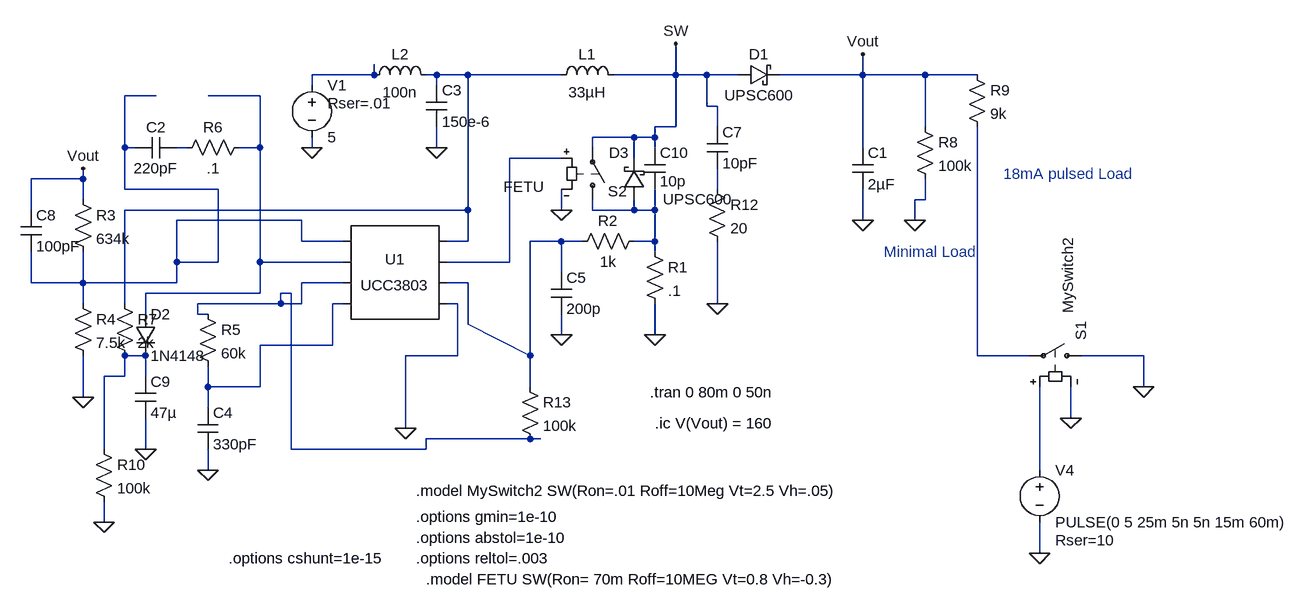
[diagram p0: schematic BoostSupply_160v.asc]
BoostSupply_160v.asc, the LTspice schematic file:
Version 4
SHEET 1 1576 680
WIRE 112 -144 112 -160
WIRE 112 -144 16 -144
WIRE 208 -144 192 -144
WIRE 256 -144 208 -144
WIRE 400 -144 256 -144
WIRE 576 -144 576 -192
WIRE 576 -144 480 -144
WIRE 624 -144 576 -144
WIRE 672 -144 624 -144
WIRE 864 -144 864 -176
WIRE 864 -144 736 -144
WIRE 960 -144 864 -144
WIRE 1040 -144 960 -144
WIRE 16 -128 16 -144
WIRE 208 -128 208 -144
WIRE -224 -112 -272 -112
WIRE -64 -112 -144 -112
WIRE 624 -96 624 -144
WIRE 640 -96 624 -96
WIRE 576 -64 576 -144
WIRE 576 -64 544 -64
WIRE 640 -64 640 -96
WIRE 960 -64 960 -144
WIRE 512 -48 448 -48
WIRE 544 -48 544 -64
WIRE 544 -48 512 -48
WIRE -272 -32 -272 -112
WIRE -256 -32 -272 -32
WIRE -176 -32 -192 -32
WIRE -64 -32 -64 -112
WIRE -64 -32 -96 -32
WIRE 16 -32 16 -48
WIRE 208 -32 208 -64
WIRE 448 -32 448 -48
WIRE 544 -32 544 -48
WIRE 864 -32 864 -144
WIRE 400 -16 320 -16
WIRE 512 -16 512 -48
WIRE -336 16 -336 0
WIRE -336 16 -416 16
WIRE -272 32 -272 -32
WIRE -128 32 -272 32
WIRE 640 32 640 0
WIRE -336 48 -336 16
WIRE 960 48 960 16
WIRE 960 48 944 48
WIRE -416 64 -416 16
WIRE 256 64 256 -144
WIRE 256 64 -272 64
WIRE 400 64 400 32
WIRE 448 64 448 48
WIRE 512 64 512 48
WIRE 512 64 448 64
WIRE 544 64 544 32
WIRE 544 64 512 64
WIRE 0 80 -192 80
WIRE 864 80 864 32
WIRE 944 80 944 48
WIRE 0 112 0 80
WIRE 64 112 0 112
WIRE 256 112 256 64
WIRE 256 112 224 112
WIRE 400 112 352 112
WIRE 432 112 400 112
WIRE 544 112 544 64
WIRE 544 112 512 112
WIRE 544 128 544 112
WIRE -192 144 -192 80
WIRE -128 144 -128 32
WIRE -128 144 -192 144
WIRE -64 144 -64 -32
WIRE 64 144 -64 144
WIRE 320 144 320 -16
WIRE 320 144 224 144
WIRE 400 160 400 112
WIRE -416 176 -416 128
WIRE -336 176 -336 128
WIRE -336 176 -416 176
WIRE -192 176 -192 144
WIRE -192 176 -336 176
WIRE 64 176 0 176
WIRE 256 176 224 176
WIRE -64 192 -64 144
WIRE -64 192 -240 192
WIRE -16 192 -32 192
WIRE -336 208 -336 176
WIRE -272 208 -272 64
WIRE -32 208 -32 192
WIRE -32 208 -160 208
WIRE 0 208 0 176
WIRE 0 208 -32 208
WIRE 64 208 48 208
WIRE 240 208 224 208
WIRE 640 208 640 112
WIRE -240 224 -240 192
WIRE -160 224 -160 208
WIRE -144 224 -160 224
WIRE 256 240 256 176
WIRE 400 256 400 224
WIRE 544 256 544 208
WIRE 48 272 48 208
WIRE 48 272 -64 272
WIRE -240 288 -272 288
WIRE 240 288 240 208
WIRE 240 288 160 288
WIRE 352 288 352 112
WIRE 352 288 256 240
WIRE 1040 288 1040 -64
WIRE 1120 288 1040 288
WIRE 1296 288 1200 288
WIRE -272 320 -272 288
WIRE -272 320 -304 320
WIRE -240 320 -240 288
WIRE -144 336 -144 304
WIRE -64 336 -64 272
WIRE -64 336 -144 336
WIRE 352 336 352 288
WIRE 1296 336 1296 288
WIRE -336 352 -336 288
WIRE -144 368 -144 336
WIRE 1184 384 1184 336
WIRE 160 400 160 288
WIRE 352 416 192 416
WIRE 368 416 352 416
WIRE -304 432 -304 320
WIRE -240 432 -240 384
WIRE -16 432 -16 192
WIRE 192 432 192 416
WIRE 192 432 -16 432
WIRE -144 464 -144 432
WIRE 1136 464 1136 336
WIRE -304 544 -304 512
WIRE 1136 592 1136 544
FLAG 208 -32 0
FLAG 864 80 0
FLAG 544 256 0
FLAG 160 400 0
FLAG 400 256 0
FLAG 16 -32 0
FLAG 864 -176 Vout
FLAG -336 0 Vout
FLAG -336 352 0
FLAG -144 464 0
FLAG 944 80 0
FLAG 1184 384 0
FLAG 1136 592 0
FLAG 1296 336 0
FLAG 640 208 0
FLAG -240 432 0
FLAG -304 544 0
FLAG 400 64 0
FLAG 576 -192 SW
SYMBOL res 528 112 R0
SYMATTR InstName R1
SYMATTR Value .1
SYMBOL ind 384 -128 R270
WINDOW 0 32 56 VTop 2
WINDOW 3 5 56 VBottom 2
SYMATTR InstName L1
SYMATTR Value 33µH
SYMATTR SpiceLine Rser=.045
SYMBOL schottky 672 -128 R270
WINDOW 0 32 32 VTop 2
WINDOW 3 0 32 VBottom 2
SYMATTR InstName D1
SYMATTR Value UPSC600
SYMATTR Description Diode
SYMATTR Type diode
SYMBOL cap 848 -32 R0
SYMATTR InstName C1
SYMATTR Value 2µF
SYMBOL cap 192 -128 R0
SYMATTR InstName C3
SYMATTR Value 150e-6
SYMATTR SpiceLine Lser=.05n
SYMBOL res 528 96 R90
WINDOW 0 0 56 VBottom 2
WINDOW 3 32 56 VTop 2
SYMATTR InstName R2
SYMATTR Value 1k
SYMBOL cap 384 160 R0
SYMATTR InstName C5
SYMATTR Value 200p
SYMBOL voltage 16 -144 R0
WINDOW 123 0 0 Left 2
WINDOW 39 24 44 Left 2
SYMATTR SpiceLine Rser=.01
SYMATTR InstName V1
SYMATTR Value 5
SYMBOL res -352 32 R0
SYMATTR InstName R3
SYMATTR Value 634k
SYMBOL res -352 192 R0
SYMATTR InstName R4
SYMATTR Value 7.5k
SYMBOL cap -192 -48 R90
WINDOW 0 0 32 VBottom 2
WINDOW 3 32 32 VTop 2
SYMATTR InstName C2
SYMATTR Value 220pF
SYMBOL cap -160 368 R0
SYMATTR InstName C4
SYMATTR Value 330pF
SYMBOL res -160 208 R0
SYMATTR InstName R5
SYMATTR Value 60k
SYMBOL res -80 -48 R90
WINDOW 0 0 56 VBottom 2
WINDOW 3 32 56 VTop 2
SYMATTR InstName R6
SYMATTR Value .1
SYMBOL res 944 -80 R0
SYMATTR InstName R8
SYMATTR Value 100k
SYMBOL res 1024 -160 R0
SYMATTR InstName R9
SYMATTR Value 9k
SYMBOL voltage 1136 448 R0
WINDOW 123 0 0 Left 2
WINDOW 39 24 124 Left 2
SYMATTR SpiceLine Rser=10
SYMATTR InstName V4
SYMATTR Value PULSE(0 5 25m 5n 5n 15m 60m)
SYMBOL sw 1216 288 M270
WINDOW 3 65 36 Left 2
SYMATTR Value MySwitch2
SYMATTR InstName S1
SYMBOL cap 624 -64 R0
SYMATTR InstName C7
SYMATTR Value 10pF
SYMBOL res 624 16 R0
SYMATTR InstName R12
SYMATTR Value 20
SYMBOL cap -432 64 R0
SYMATTR InstName C8
SYMATTR Value 100pF
SYMBOL cap -256 320 R0
SYMATTR InstName C9
SYMATTR Value 47µ
SYMBOL res -288 192 R0
SYMATTR InstName R7
SYMATTR Value 2k
SYMBOL diode -256 224 R0
SYMATTR InstName D2
SYMATTR Value 1N4148
SYMBOL res -320 416 R0
SYMATTR InstName R10
SYMATTR Value 100k
SYMBOL sw 448 64 M180
WINDOW 3 -137 36 Left 2
WINDOW 0 24 29 Left 2
SYMATTR Value FETU
SYMATTR InstName S2
SYMBOL schottky 528 48 R180
WINDOW 0 24 72 Left 2
WINDOW 3 -135 1 Left 2
SYMATTR InstName D3
SYMATTR Value UPSC600
SYMATTR Description Diode
SYMATTR Type diode
SYMBOL cap 528 -32 R0
WINDOW 3 24 52 Left 2
SYMATTR Value 10p
SYMATTR InstName C10
SYMATTR SpiceLine Rser=10m
SYMBOL res 336 320 R0
SYMATTR InstName R13
SYMATTR Value 100k
SYMBOL ind 96 -128 R270
WINDOW 0 32 56 VTop 2
WINDOW 3 5 56 VBottom 2
SYMATTR InstName L2
SYMATTR Value 100n
SYMATTR SpiceLine Rser=.02
SYMBOL AutoGenerated\\UCC3803 144 160 R0
SYMATTR InstName U1
TEXT 536 344 Left 2 !.tran 0 80m 0 50n
TEXT 544 392 Left 2 !.ic V(Vout) = 160
TEXT 176 496 Left 2 !.model MySwitch2 SW(Ron=.01 Roff=10Meg Vt=2.5 Vh=.05)
TEXT 176 536 Left 2 !.options gmin=1e-10
TEXT 176 568 Left 2 !.options abstol=1e-10
TEXT 176 600 Left 2 !.options reltol=.003
TEXT -112 600 Left 2 !.options cshunt=1e-15
TEXT 192 632 Left 2 !.model FETU SW(Ron= 70m Roff=10MEG Vt=0.8 Vh=-0.3)
TEXT 1080 8 Left 2 ;18mA pulsed Load
TEXT 896 128 Left 2 ;Minimal Load

The netlist it stands for:
* BoostSupply_160v.asc
R1 N008 0 .1
L1 N002 SW 33µH Rser=.045
D1 SW Vout UPSC600
C1 Vout 0 2µF
C3 N002 0 150e-6 Lser=.05n
R2 N008 N009 1k
C5 N009 0 200p
V1 N001 0 5 Rser=.01
R3 Vout N003 634k
R4 N003 0 7.5k
C2 N005 N003 220pF
C4 N011 0 330pF
R5 N010 N011 60k
R6 N004 N005 .1
R8 Vout 0 100k
R9 Vout N013 9k
V4 N014 0 PULSE(0 5 25m 5n 5n 15m 60m) Rser=10
S1 0 N013 N014 0 MySwitch2
C7 SW N007 10pF
R12 N007 0 20
C8 Vout N003 100pF
C9 N012 0 47µ
R7 N002 N012 2k
D2 N004 N012 1N4148
R10 N012 0 100k
S2 N008 SW N006 0 FETU
D3 N008 SW UPSC600
C10 SW N008 10p Rser=10m
R13 N009 N010 100k
L2 N001 N002 100n Rser=.02
* U1: UCC3803 (symbol AutoGenerated\UCC3803 not available, pins judged from their places): pin1=N003 pin2=N004 pin3=N010 pin4=N011 pin5=N002 pin6=N006 pin7=N009 pin8=0
.model D D
.lib standard.dio
.tran 0 80m 0 50n
.ic V(Vout) = 160
.model MySwitch2 SW(Ron=.01 Roff=10Meg Vt=2.5 Vh=.05)
.options gmin=1e-10
.options abstol=1e-10
.options reltol=.003
.options cshunt=1e-15
.model FETU SW(Ron= 70m Roff=10MEG Vt=0.8 Vh=-0.3)
* 18mA pulsed Load
* Minimal Load
.backanno
.end